# EAGLE design to-pcbway (EAGLE 7.5.0)
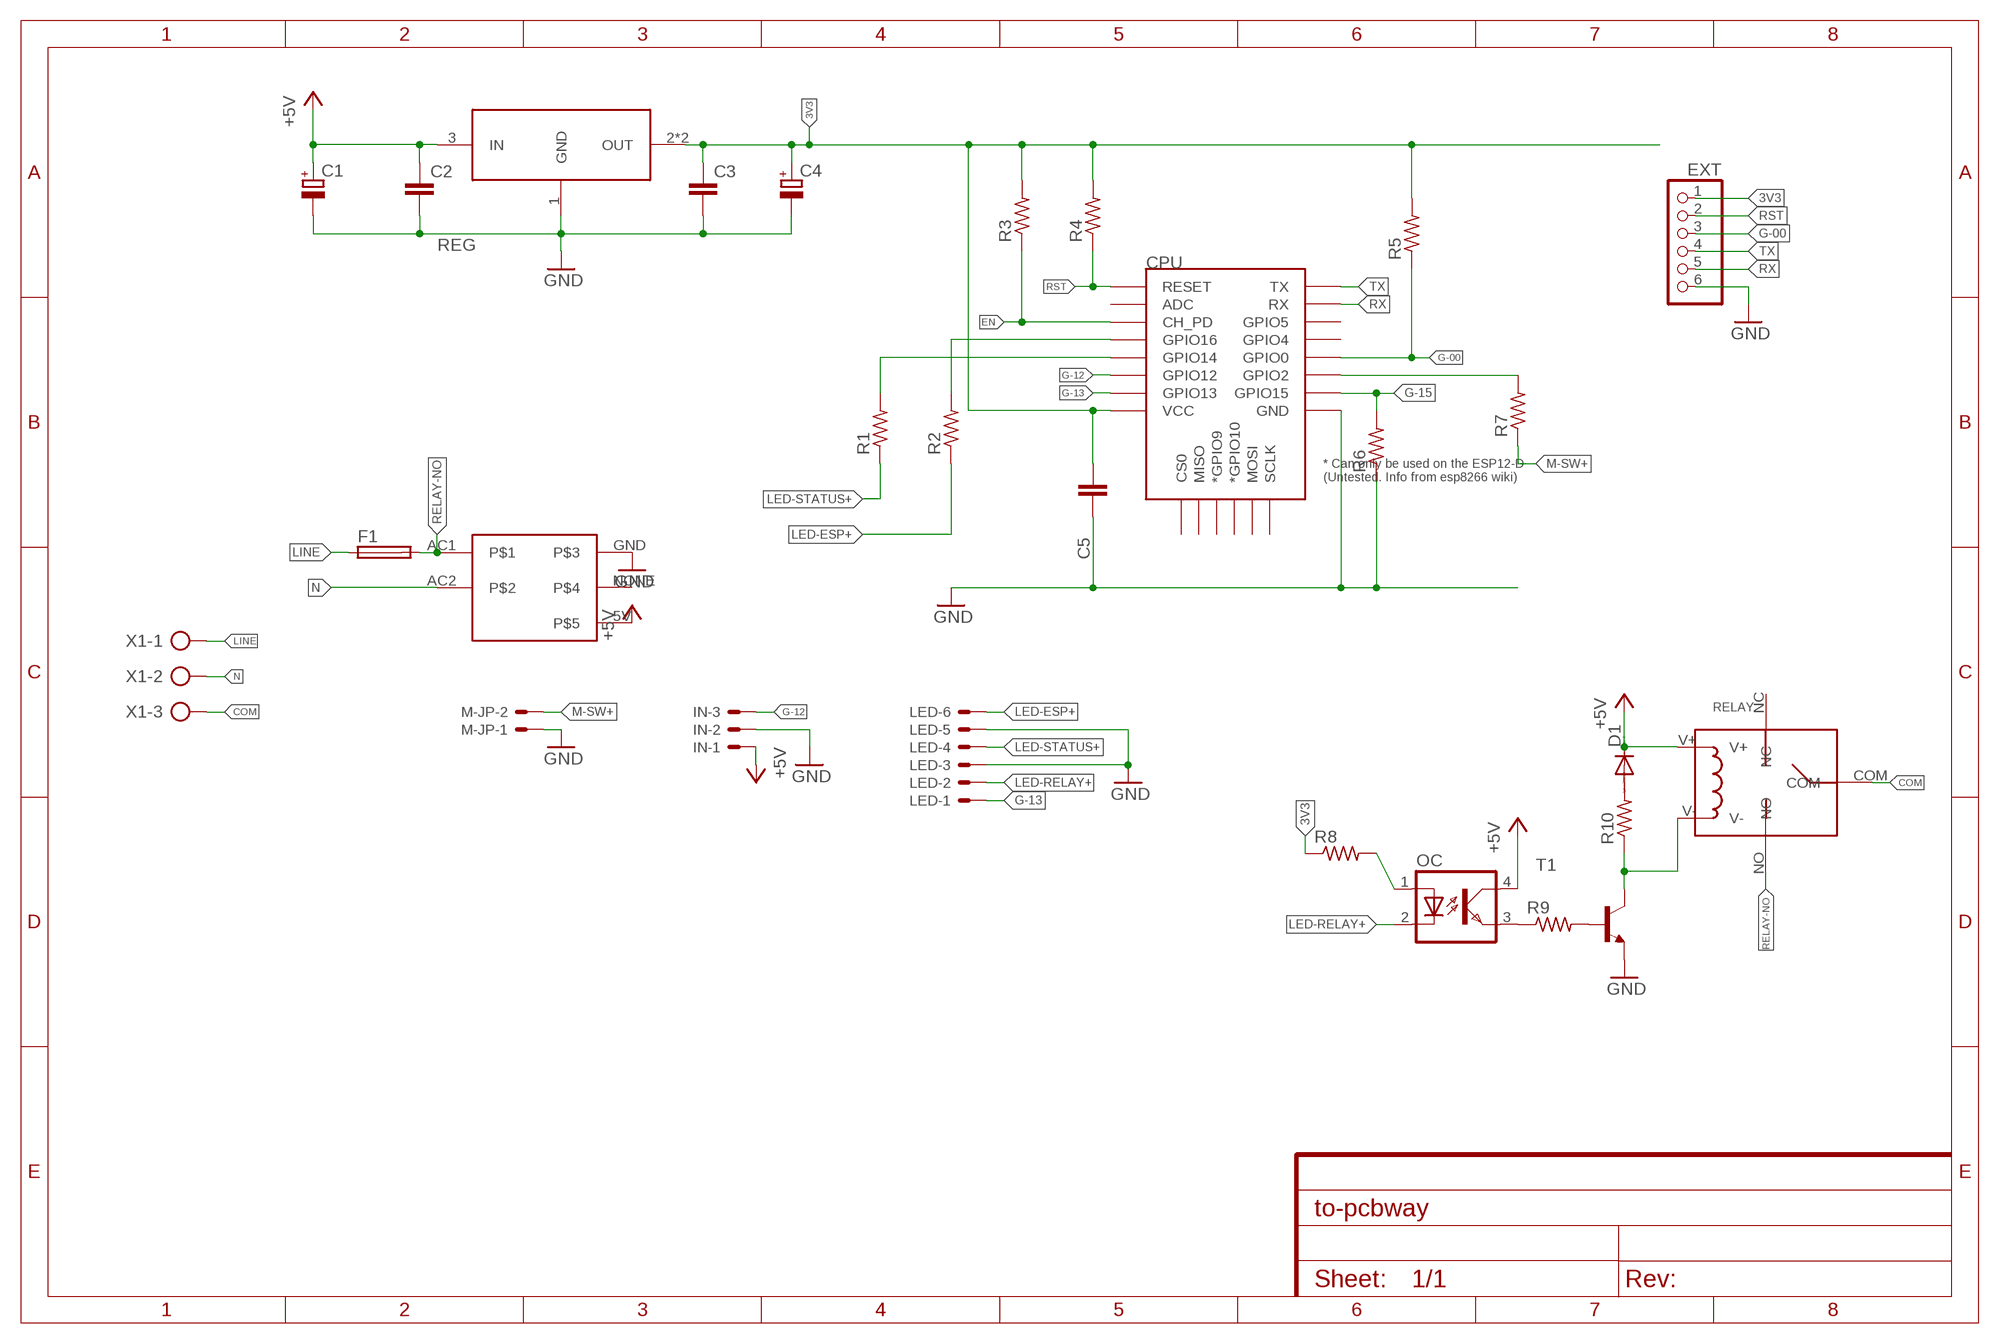
[diagram p0: schematic, sheet 1]

## Parts
C1  CPOL-EUE2-5  [E2-5]
C2  C-EUC0603K  [C0603K]
C3  C-EUC0603K  [C0603K]
C4  CPOL-EUE2-5  [E2-5]
C5  C-EUC0805  [C0805]
CPU  ESP12ESMD  [ESP12E-SMD]
D1  1N4148DO35-7  [DO35-7]
EXT  PINHD-1X6  [1X06]
F1  FUSESH22,5  [SH22,5]
IN  53048-03  [53048-03]
LED  53048-06  [53048-06]
M-JP  53048-02  [53048-02]
OC  PC817  [DIL04]
R1  R-US_R0603  [R0603]
R2  R-US_R0603  [R0603]
R3  R-US_R0603  [R0603]
R4  R-US_R0603  [R0603]
R5  R-US_R0603  [R0603]
R6  R-US_R0603  [R0603]
R7  R-US_R0603  [R0603]
R8  R-US_M0805  [M0805]
R9  R-US_M0805  [M0805]
R10  R-US_M0805  [M0805]
REG  AMS1117-3.3  [SOT-223]
RELAY  RELAY-SONGLE  [RELAY-SONGLE]
T1  BC817-NPN-SOT23-BEC  [SOT23-BEC]
U$4  POWERSUPPLY-5V-700MA  [POWERSUPPLY-5V-700MA]
X1  AK300/3  [AK300/3]

## Nets
3V3: C3.1 C4.+ C5.1 CPU.VCC EXT.1 R3.2 R4.2 R5.2 R8.1 REG.2(OUT) REG.4(OUT)
+5V: C1.+ C2.1 D1.C IN.1 OC.4(COL) REG.3(IN) RELAY.V+ U$4.5V
COM: RELAY.COM X1.3
EN: CPU.CH_PD R3.1
G-00: CPU.GPIO0 EXT.3 R5.1
G-12: CPU.GPIO12 IN.3
G-13: CPU.GPIO13 LED.1
G-15: CPU.GPIO15 R6.2
GND: C1.- C2.2 C3.2 C4.- C5.2 CPU.GND EXT.6 IN.2 LED.3 LED.5 M-JP.1 R6.1 REG.1(GND) T1.E U$4.GND
LED-ESP+: LED.6 R2.1
LED-RELAY+: LED.2 OC.2(C)
LED-STATUS+: LED.4 R1.1
LINE: F1.1 X1.1
M-SW+: M-JP.2 R7.1
N: U$4.AC2 X1.2
N$1: OC.3(EMIT) R9.1
N$2: R9.2 T1.B
N$4: CPU.GPIO16 R2.2
N$7: CPU.GPIO2 R7.2
N$8: CPU.GPIO14 R1.2
N$13: OC.1(A) R8.2
N$16: D1.A R10.2
N$17: R10.1 RELAY.V- T1.C
RELAY-NO: F1.2 RELAY.NO U$4.AC1
RST: CPU.RESET EXT.2 R4.1
RX: CPU.RXD0(RX) EXT.5
TX: CPU.TXD0(TX) EXT.4
Unconnected: CPU.ADC CPU.CS0 CPU.GPIO4 CPU.GPIO5 CPU.GPIO9(*GPIO9) CPU.GPIO10(*GPIO10) CPU.MISO CPU.MOSI CPU.SCLK RELAY.NC U$4.NONE

## Library data of the parts
C1 C4 = rcl:CPOL-EU: POLARIZED CAPACITOR, European symbol
C2 C3 C5 = rcl:C-EU: CAPACITOR, European symbol
CPU = esp8266modules:ESP12E: ESP12E Module
D1 = diode:1N4148: DIODE high speed (Philips)
EXT = pinhead:PINHD-1X6: PIN HEADER
F1 = fuse:FUSE: Fuse; OC_FARNELL: unknown; OC_NEWARK: unknown
IN = con-molex:53?-03: CONNECTOR wire to board 1.25 mm (.049 inch) pitch header; MF: WALDOM/MOLEX; MPN: 53048-0310; OC_FARNELL: 9732918; OC_NEWARK: 38C9908
LED = con-molex:53?-06: CONNECTOR wire to board 1.25 mm (.049 inch) pitch header; MF: WALDOM/MOLEX; MPN: 53048-0610; OC_FARNELL: 1012260; OC_NEWARK: 38C9911
M-JP = con-molex:53?-02: CONNECTOR wire to board 1.25 mm (.049 inch) pitch header; MF: MOLEX; MPN: 53048-0210; OC_FARNELL: 1012259; OC_NEWARK: 57H4718
OC = optocoupler:PC817: SHARP OPTO COUPLER; MPN: PC817X4J000F; OC_FARNELL: 9707727; OC_NEWARK: 97K7059
R1-R10 = rcl:R-US_: RESISTOR, American symbol
REG = AMS1117-3.3:AMS1117-3.3: 1A LOW DROPOUT VOLTAGE REGULATOR
RELAY = Seeed-OPL-Relay:RELAY-SONGLE
T1 = transistor-neu-to92:*-NPN-: NPN Transistror
U$4 = PowerSupply-5V-700mA:POWERSUPPLY-5V-700MA
X1 = con-ptr500:AK300/3: CONNECTOR; OC_FARNELL: unknown; OC_NEWARK: unknown

## Board
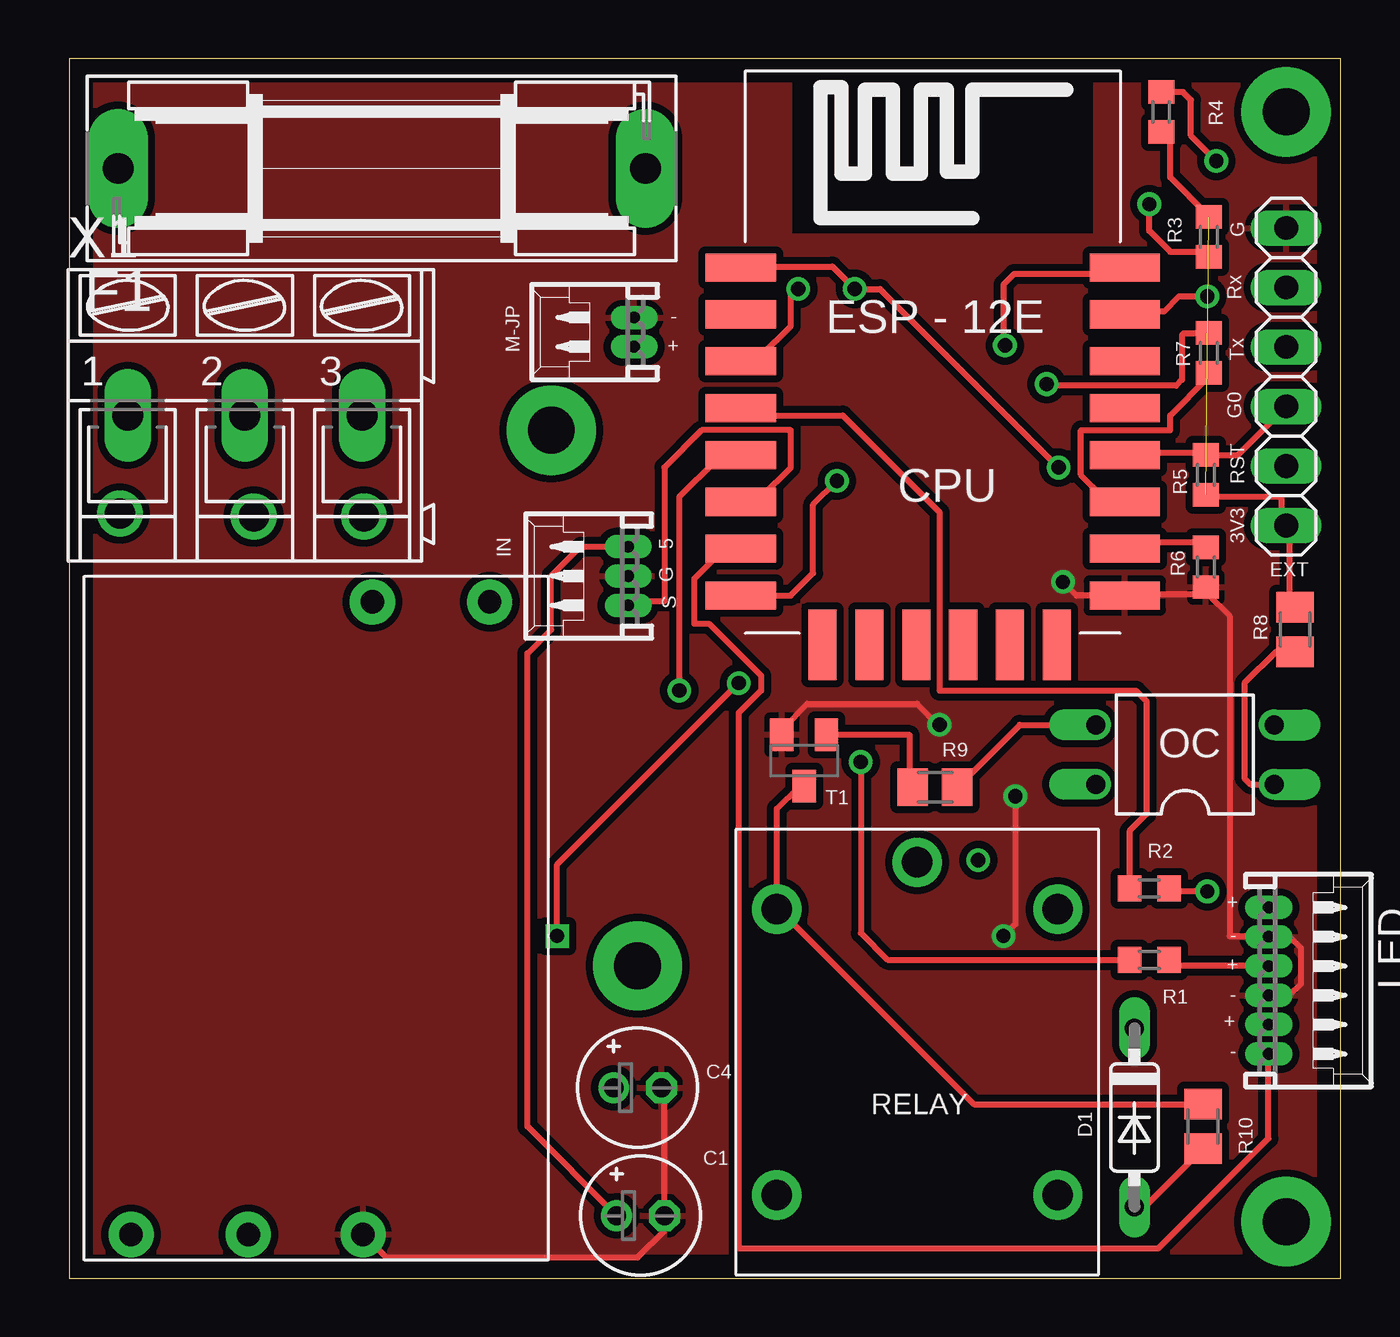
[diagram p1: board, top side]
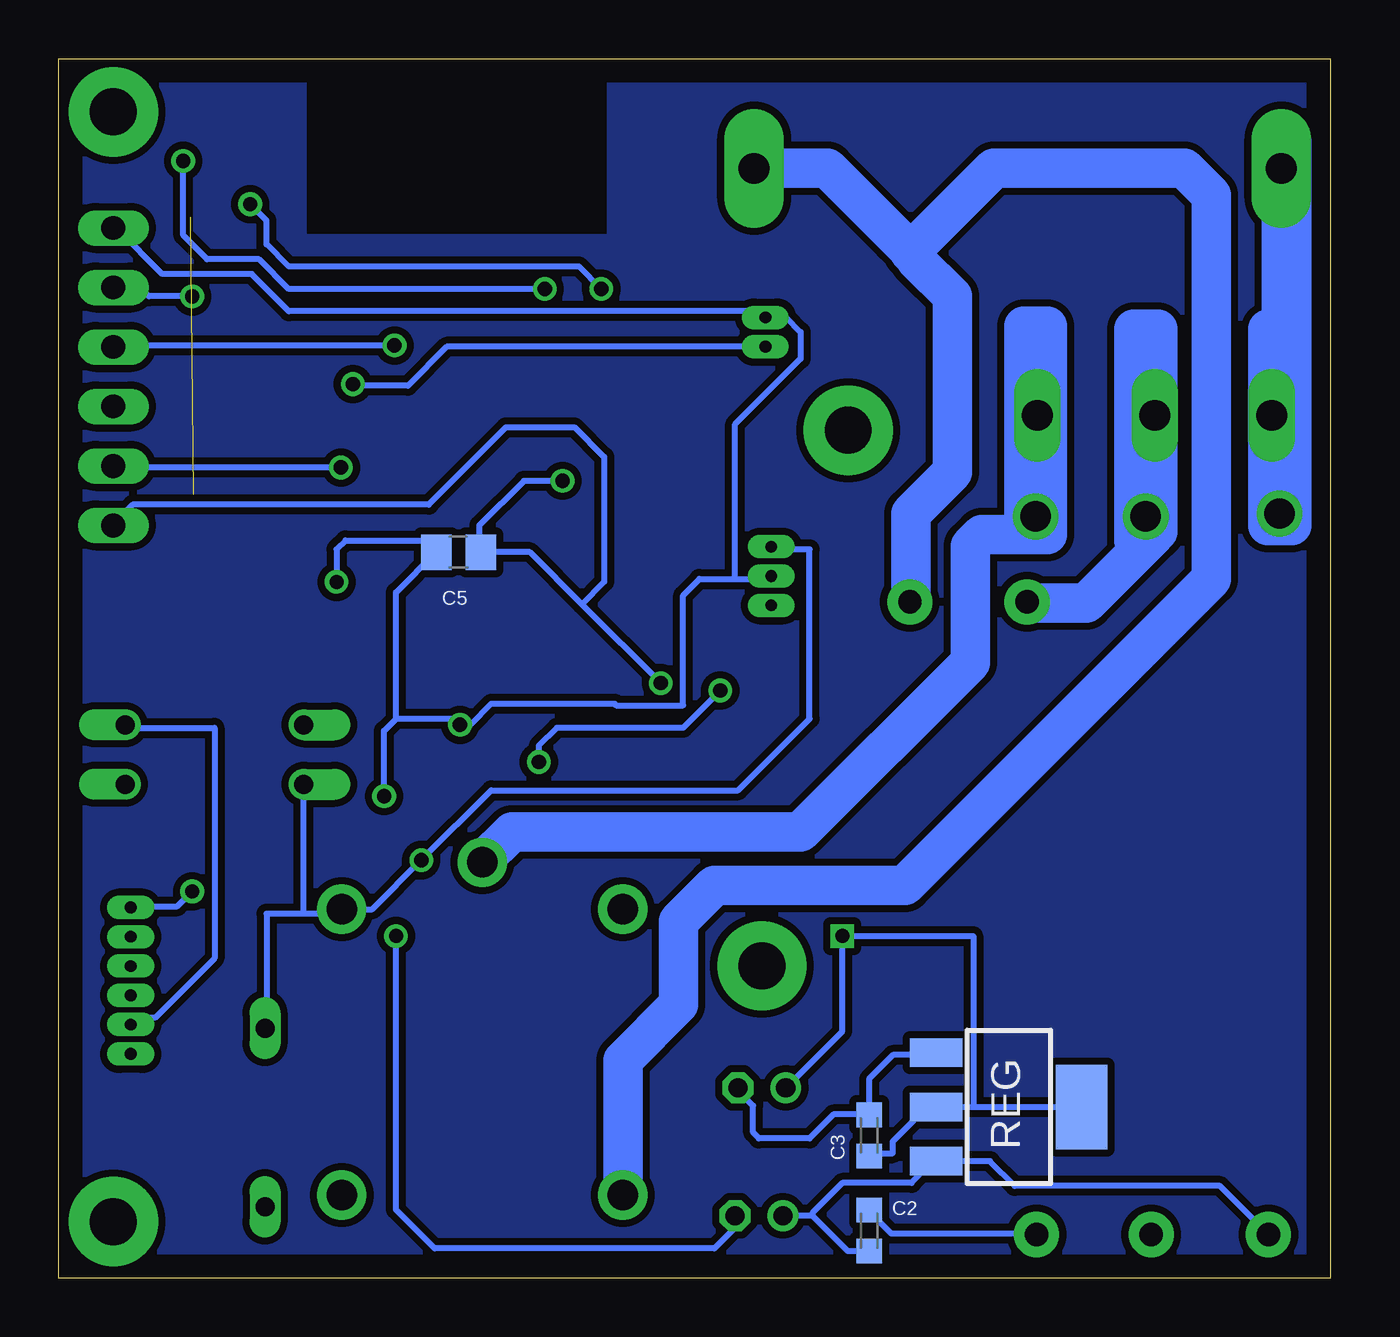
[diagram p2: board, bottom side, seen from below]

Size 54.28 x 52.06 mm. Coordinates in mm from the lower left corner, seen from the top.
Outline: 0,0 54.28,0 54.28,52.06 0,52.06 0,0
Copper layers (1*16): Top 0.035mm / dielectric 1.5mm / Bottom 0.035mm
Design rules "default": minimum track width 10mil, minimum drill 24mil, track to track 8mil, track to pad 8mil, pad to pad 8mil, via to via 8mil, smd to smd 8mil, copper to edge 40mil, drill to drill 8mil, minimum pad ring 10mil, minimum via ring 8mil, stop-mask expansion 4mil, vias tented up to drill 0mil, thermal gap 10mil

### Footprints (pad centres in the part's own frame; a part is rotated, then mirrored left to right if it is on the bottom)
E2-5 = drill 0.813 pad 1.27: + -1.016,0 | drill 0.813 pad 1.27 octagon: - 1.016,0
C0603K = smd 1.05 x 1.08: 1 -0.875,0; 2 0.875,0
C0805 = smd 1.3 x 1.5: 1 -0.95,0; 2 0.95,0
ESP12E-SMD = smd 3 x 1.2: ADC -8.3,3.8; CH_PD -8.3,1.8; GND 8.1,-8.2; GPIO0 8.1,-2.2; GPIO2 8.1,-4.2; GPIO4 8.1,-0.2; GPIO5 8.1,1.8; GPIO12 -8.3,-4.2; GPIO13 -8.3,-6.2; GPIO14 -8.3,-2.2; GPIO15 8.1,-6.2; GPIO16 -8.3,-0.2; RESET -8.3,5.8; RXD0 8.1,3.8; TXD0 8.1,5.8; VCC -8.3,-8.2 | smd 1.2 x 3: CS0 -4.8,-10.3; GPIO9 -0.8,-10.3; GPIO10 1.2,-10.3; MISO -2.8,-10.3; MOSI 3.2,-10.3; SCLK 5.2,-10.3
DO35-7 = drill 0.813 long: A 3.81,0; C -3.81,0
1X06 = drill 1.016 long: 1 -6.35,0; 2 -3.81,0; 3 -1.27,0; 4 1.27,0; 5 3.81,0; 6 6.35,0
SH22,5 = drill 1.321 pad 2.54 long: 1 -11.252,0; 2 11.252,0
53048-03 = drill 0.5 pad 0.698 long: 1 1.25,-1.25; 2 0,-1.25; 3 -1.25,-1.25
53048-06 = drill 0.5 pad 0.698 long: 1 3.125,-1.25; 2 1.875,-1.25; 3 0.625,-1.25; 4 -0.625,-1.25; 5 -1.875,-1.25; 6 -3.125,-1.25
53048-02 = drill 0.5 pad 0.698 long: 1 0.625,-1.25; 2 -0.625,-1.25
DIL04 = drill 0.813 offset: 1 -1.27,-3.81; 2 1.27,-3.81; 3 1.27,3.81; 4 -1.27,3.81
R0603 = smd 1 x 1.1: 1 -0.85,0; 2 0.85,0
M0805 = smd 1.3 x 1.6: 1 -0.95,0; 2 0.95,0
SOT-223 = smd 1.219 x 2.235: 1 -2.381,-3.099; 2 -0.07,-3.099; 3 2.241,-3.099 | smd 3.6 x 2.2: 4 -0.07,3.099
RELAY-SONGLE = drill 1.3 pad 2.1: COM -8.1,0; NC 6.1,6; NO 6.1,-6; V+ -6.1,6; V- -6.1,-6
SOT23-BEC = smd 1 x 1.4: B -0.95,-1.1; C 0,1.1; E 0.95,-1.1
POWERSUPPLY-5V-700MA = drill 1 pad 1.93: 5V 13.5,-7.9; AC1 -13.5,7.4; AC2 -13.5,2.4; GND 13.5,2; NONE 13.5,-2.9
AK300/3 = drill 1.321 long: 1 -5.004,0; 2 0,0; 3 5.004,0

### Placement (x,y rotation side)
C1  24.38,2.67 0 top
C2  19.68,2.03 90 bottom
C3  19.68,6.1 90 bottom
C4  24.26,8.13 0 top
C5  37.21,30.99 180 bottom
CPU  36.96,37.34 0 top
D1  45.47,6.86 270 top
EXT  51.94,38.48 90 top
F1  13.34,47.37 0 top
IN  22.61,29.97 90 top
LED  52.45,12.7 270 top
M-JP  22.86,40.39 90 top
OC  47.62,22.35 90 top
R1  46.1,13.59 180 top
R2  46.1,16.64 180 top
R3  48.64,44.45 90 top
R4  46.61,49.78 270 top
R5  48.51,34.29 270 top
R6  48.51,30.35 90 top
R7  48.64,39.5 270 top
R8  52.32,27.69 270 top
R9  36.96,20.95 180 top
R10  48.39,6.48 270 top
REG  13.72,7.24 270 bottom
RELAY  36.2,9.65 270 top
T1  31.37,22.1 180 top
U$4  10.54,15.37 270 top
X1  7.49,36.83 0 top

### Tracks (layer width: path | path; a pad name or v marks a point on that pad's centre or on a via)
3V3  (via drill 0.6)  (1 unrouted)
  Top 0.254: v20.83,14.61 20.83,17.65 v28.57,25.4 | R5.2 48.58,33.34 51.75,33.34 51.75,32.38 EXT.1 52.07,32.07 52.07,28.89 R8.1 | R4.2 46.67,48.9 46.99,48.58 46.99,46.99 48.58,45.4 R3.2 | CPU.VCC 30.79,29.14 31.75,30.1 31.75,33.02 v32.77,34.04
  Bottom 0.254: C4.+ 20.83,10.54 v20.83,14.61 15.24,14.61 15.24,7.3 | v28.57,25.4 31.94,28.77 | 31.94,28.77 34.16,30.99 C5.1 36.32,31.05 36.32,32.13 34.42,34.04 v32.77,34.04 | C3.1 19.68,5.4 19.62,5.33 18.67,5.33 18.67,5.84 17.78,6.73 17.78,7.3 16.83,7.3 REG.2 16.51,7.3 15.24,7.3 | 15.24,7.3 10.79,7.3 REG.4 | EXT.1 51.75,32.38 51.12,33.02 38.48,33.02 35.18,36.32 32.26,36.32 30.99,35.05 30.99,29.72 31.94,28.77
+5V  (via drill 0.61)
  Top 0.254: C1.+ 19.56,6.48 19.56,26.67 20.57,27.69 20.57,29.97 21.82,31.22 IN.1 23.81,31.11
  Bottom 0.254: 43.81,15.56 42.23,15.56 RELAY.V+ 40.89,15.75 v38.8,17.84 35.81,20.83 25.27,20.83 22.23,23.88 22.23,31.11 23.81,31.11 IN.1 | 43.81,15.56 45.4,15.56 45.4,10.79 D1.C | 43.81,15.56 OC.4 | U$4.5V 4.71,3.94 13.46,3.94 14.52,5 REG.3 16.94,5 17.88,4.06 20.83,4.06 22.1,2.79 22.1,2.67 | 22.1,2.67 C1.+ | C2.1 20.59,1.16 22.1,2.67
COM
  Bottom 1.676: RELAY.COM 36.2,17.78 34.92,19.05 22.61,19.05 15.37,26.29 15.37,31.24 14.86,31.75 13.08,31.75 | 13.08,31.75 12.95,31.75 | 12.95,31.75 12.83,31.88 | 12.83,31.88 12.5,32.21 X1.3 | 12.83,31.88 12.06,31.88 12.06,40.64 13.08,40.64 13.08,31.75 | 12.95,31.75 12.06,31.75
EN  (via drill 0.61)
  Top 0.254: v31.11,42.23 30.8,41.91 30.8,40.64 29.53,39.37 28.89,39.37 CPU.CH_PD | R3.1 48.58,43.81 46.99,43.81 46.1,44.7 v46.1,45.85
  Bottom 0.254: v31.11,42.23 32.07,43.18 44.45,43.18 45.4,44.13 45.4,45.15 v46.1,45.85
G-00
  Top 0.254: CPU.GPIO0 45.09,35.24 48.26,35.24 R5.1 49.87,35.14 EXT.3
G-12
  Top 0.254: IN.3 24.13,28.89 25.4,28.89 25.4,34.61 26.99,36.2 30.8,36.2 30.8,34.61 29.53,33.34 28.89,33.34 CPU.GPIO12
G-13
  Top 0.254: CPU.GPIO13 28.57,31.11 27.94,31.11 26.67,29.84 26.67,27.94 27.3,27.94 29.53,25.72 29.53,25.08 28.57,24.13 28.57,1.27 46.48,1.27 51.18,5.97 51.18,9.55 LED.1
G-15
  Top 0.254: R6.2 48.26,31.43 45.09,31.43 CPU.GPIO15
GND  (via drill 0.6, 0.61)
  Top 0.254: v42.42,29.72 43,29.14 CPU.GND 45.09,29.21 48.26,29.21 R6.1 48.58,29.21 49.53,28.26 49.53,14.61 51.12,14.61 LED.5 52.1,14.57 52.58,14.1 52.58,12.57 52.07,12.06 LED.3 | T1.E 30.48,23.5 31.5,24.51 36.2,24.51 37.08,23.62 v37.15,23.62 | C4.- 25.4,7.94 C1.- 25.4,2.03 24.26,0.89 13.52,0.89 U$4.GND | v40.39,20.57 40.39,15.11 v39.88,14.61
  Bottom 0.254: C2.2 19.68,2.86 18.73,1.91 12.7,1.91 U$4.GND | REG.1 16.83,9.53 18.67,9.53 19.68,8.51 19.68,6.99 | 25.4,29.84 25.4,36.45 22.61,39.24 22.61,40.39 23.24,41.02 23.75,41.02 23.81,40.96 23.87,41.01 M-JP.1 24.11,41.26 24.13,41.27 44.45,41.27 46.04,42.86 49.85,42.86 51.75,44.77 EXT.6 | v39.88,14.61 39.88,2.92 38.23,1.27 26.29,1.27 25.4,2.16 C1.- | 39.88,23.88 39.88,29.27 C5.2 38.67,31.5 42.04,31.5 42.42,31.11 v42.42,29.72 | 19.68,6.99 C3.2 | 19.68,6.99 21.21,6.99 22.23,5.97 24.38,5.97 24.64,6.22 24.64,7.37 25.27,8 C4.- | 39.88,23.88 37.4,23.88 v37.15,23.62 36.7,23.62 35.81,24.51 30.54,24.51 30.48,24.45 27.62,24.45 27.62,29.15 26.92,29.84 25.4,29.84 | 25.4,29.84 23.98,29.84 IN.2 | v40.39,20.57 40.39,23.37 39.88,23.88
  pour Top (isolate 0.305): 0,0 54.23,0 54.23,52.07 43.81,52.07 43.81,44.45 30.73,44.45 30.73,52.07 0,52.07
LED-ESP+  (via drill 0.61)
  Top 0.254: v48.58,16.51 46.99,16.51 R2.1
  Bottom 0.254: v48.58,16.51 49.21,15.88 51.12,15.88 LED.6
LED-RELAY+
  Bottom 0.254: LED.2 51.12,11.11 50.16,11.11 47.62,13.65 47.62,23.5 51.44,23.5 OC.2
LED-STATUS+
  Top 0.254: R1.1 46.99,13.34 51.12,13.34 LED.4
LINE
  Bottom 1.676: F1.1 2.08,37.24 X1.1
M-SW+  (via drill 0.61)
  Top 0.254: R7.1 48.58,40.32 47.56,40.32 47.5,40.26 47.5,38.35 47.24,38.1 41.78,38.1 v41.72,38.16
  Bottom 0.254: M-JP.2 37.71,39.76 39.37,38.1 41.66,38.1 v41.72,38.16
N  (via drill 1.3)
  Bottom 1.676: U$4.AC2 12.9,28.83 10.41,28.83 7.49,31.75 v7.87,32.51 X1.2 7.37,36.83 | 7.37,36.96 7.37,40.51 8.38,40.51 8.38,31.5 | 7.49,36.96 7.37,36.96 | 7.37,36.96 7.37,36.83 | 7.37,36.83 7.37,31.88
N$1
  Top 0.254: R9.1 40.57,23.62 OC.3
N$2
  Top 0.254: T1.B 32.38,23.18 35.88,23.18 35.88,20.95 R9.2
N$3  (via drill 2 pad 3.81)
  other vias: 20.57,36.2
N$4
  Top 0.254: 45.09,16.83 R2.2 45.25,19.09 45.97,19.81 45.97,24.64 45.53,25.08 37.15,25.08 37.15,32.7 33.02,36.83 28.89,36.83 CPU.GPIO16
N$5  (via drill 2 pad 3.81)
  other vias: 24.26,13.34
N$6  (via drill 2 pad 3.81)
  other vias: 51.94,2.41
N$7
  Top 0.254: R7.2 48.58,38.42 46.99,36.83 46.99,36.2 43.18,36.2 43.18,34.29 44.13,33.34 44.77,33.34 CPU.GPIO2
N$8  (via drill 0.61)
  Top 0.254: v26.04,25.08 26.04,33.34 27.62,34.92 28.57,34.92 CPU.GPIO14 | 45.09,13.65 R1.2 34.92,13.59 33.78,14.73 v33.78,22.04
  Bottom 0.254: v26.04,25.08 27.62,23.5 33.02,23.5 33.78,22.73 v33.78,22.04
N$9  (via drill 2 pad 3.81)
  other vias: 51.94,49.78
N$13
  Top 0.254: R8.2 51.5,26.74 50.16,25.4 50.16,21.34 50.42,21.08 OC.1
N$16
  Top 0.254: R10.2 48.26,5.4 45.72,2.86 D1.A
N$17
  Top 0.254: T1.C 31.11,20.95 30.2,20.04 RELAY.V- 30.48,15.56 38.61,7.43 R10.1 48.26,7.62
N$18
  Bottom 1.676: 2.03,36.96 2.03,32.13 | 2.03,32.13 2.29,32.13 | 2.29,32.13 2.67,32.13 2.67,40.51 | 2.16,32.64 2.29,32.64 2.29,32.13 | 2.03,32.13 1.65,32.13 1.65,48.51
N$19  (via drill 1.3)
  other vias: 2.16,32.64
N$20  (via drill 1.3)
  other vias: 12.57,32.51
N$21
  pour Bottom (isolate 0.305): 0,0 54.23,0 54.23,52.07 43.81,52.07 43.81,44.45 30.73,44.45 30.73,52.07 0,52.07
RELAY-NO
  Bottom 0.254: 18.48,44.39 18.41,44.45 17.84,43.88
  Bottom 1.676: F1.2 21.46,47.37 18.48,44.39 17.91,43.81 | 17.94,43.78 17.84,43.88 17.65,44.07 | 17.65,44.07 14.35,47.37 6.22,47.37 5.08,46.23 5.08,29.84 18.16,16.76 26.29,16.76 27.81,15.24 27.81,11.68 30.2,9.3 RELAY.NO | U$4.AC1 17.91,28.9 17.91,32.64 16.13,34.42 16.13,41.91 17.65,43.43 17.65,44.07
RST  (via drill 0.61)
  Top 0.254: 46.67,50.48 R4.1 47.54,50.63 47.88,50.29 47.88,48.77 v48.96,47.69 | CPU.RESET 28.89,43.18 32.58,43.18 v33.53,42.23 34.61,42.23 v42.23,34.61
  Bottom 0.254: v33.53,42.23 44.45,42.23 45.72,43.5 47.94,43.5 48.96,44.51 v48.96,47.69 | v42.23,34.61 51.75,34.61 EXT.2
RX  (via drill 0.61)
  Top 0.254: CPU.RXD0 45.09,41.27 46.74,41.27 47.37,41.91 v48.58,41.91
  Bottom 0.254: v48.58,41.91 50.42,41.91 50.8,42.29 EXT.5
TX  (via drill 0.61)
  Top 0.254: CPU.TXD0 44.77,42.86 40.32,42.86 39.88,42.42 39.88,40.39 v39.94,39.81
  Bottom 0.254: v39.94,39.81 51.88,39.81 EXT.4

### Text on the board
tNames: G | Rx | - | Tx | + | G0 | RST | 5 | 3V3 | G | S | + | - | + | - | + | -